# EAGLE design robot_board (EAGLE 6.5.0)
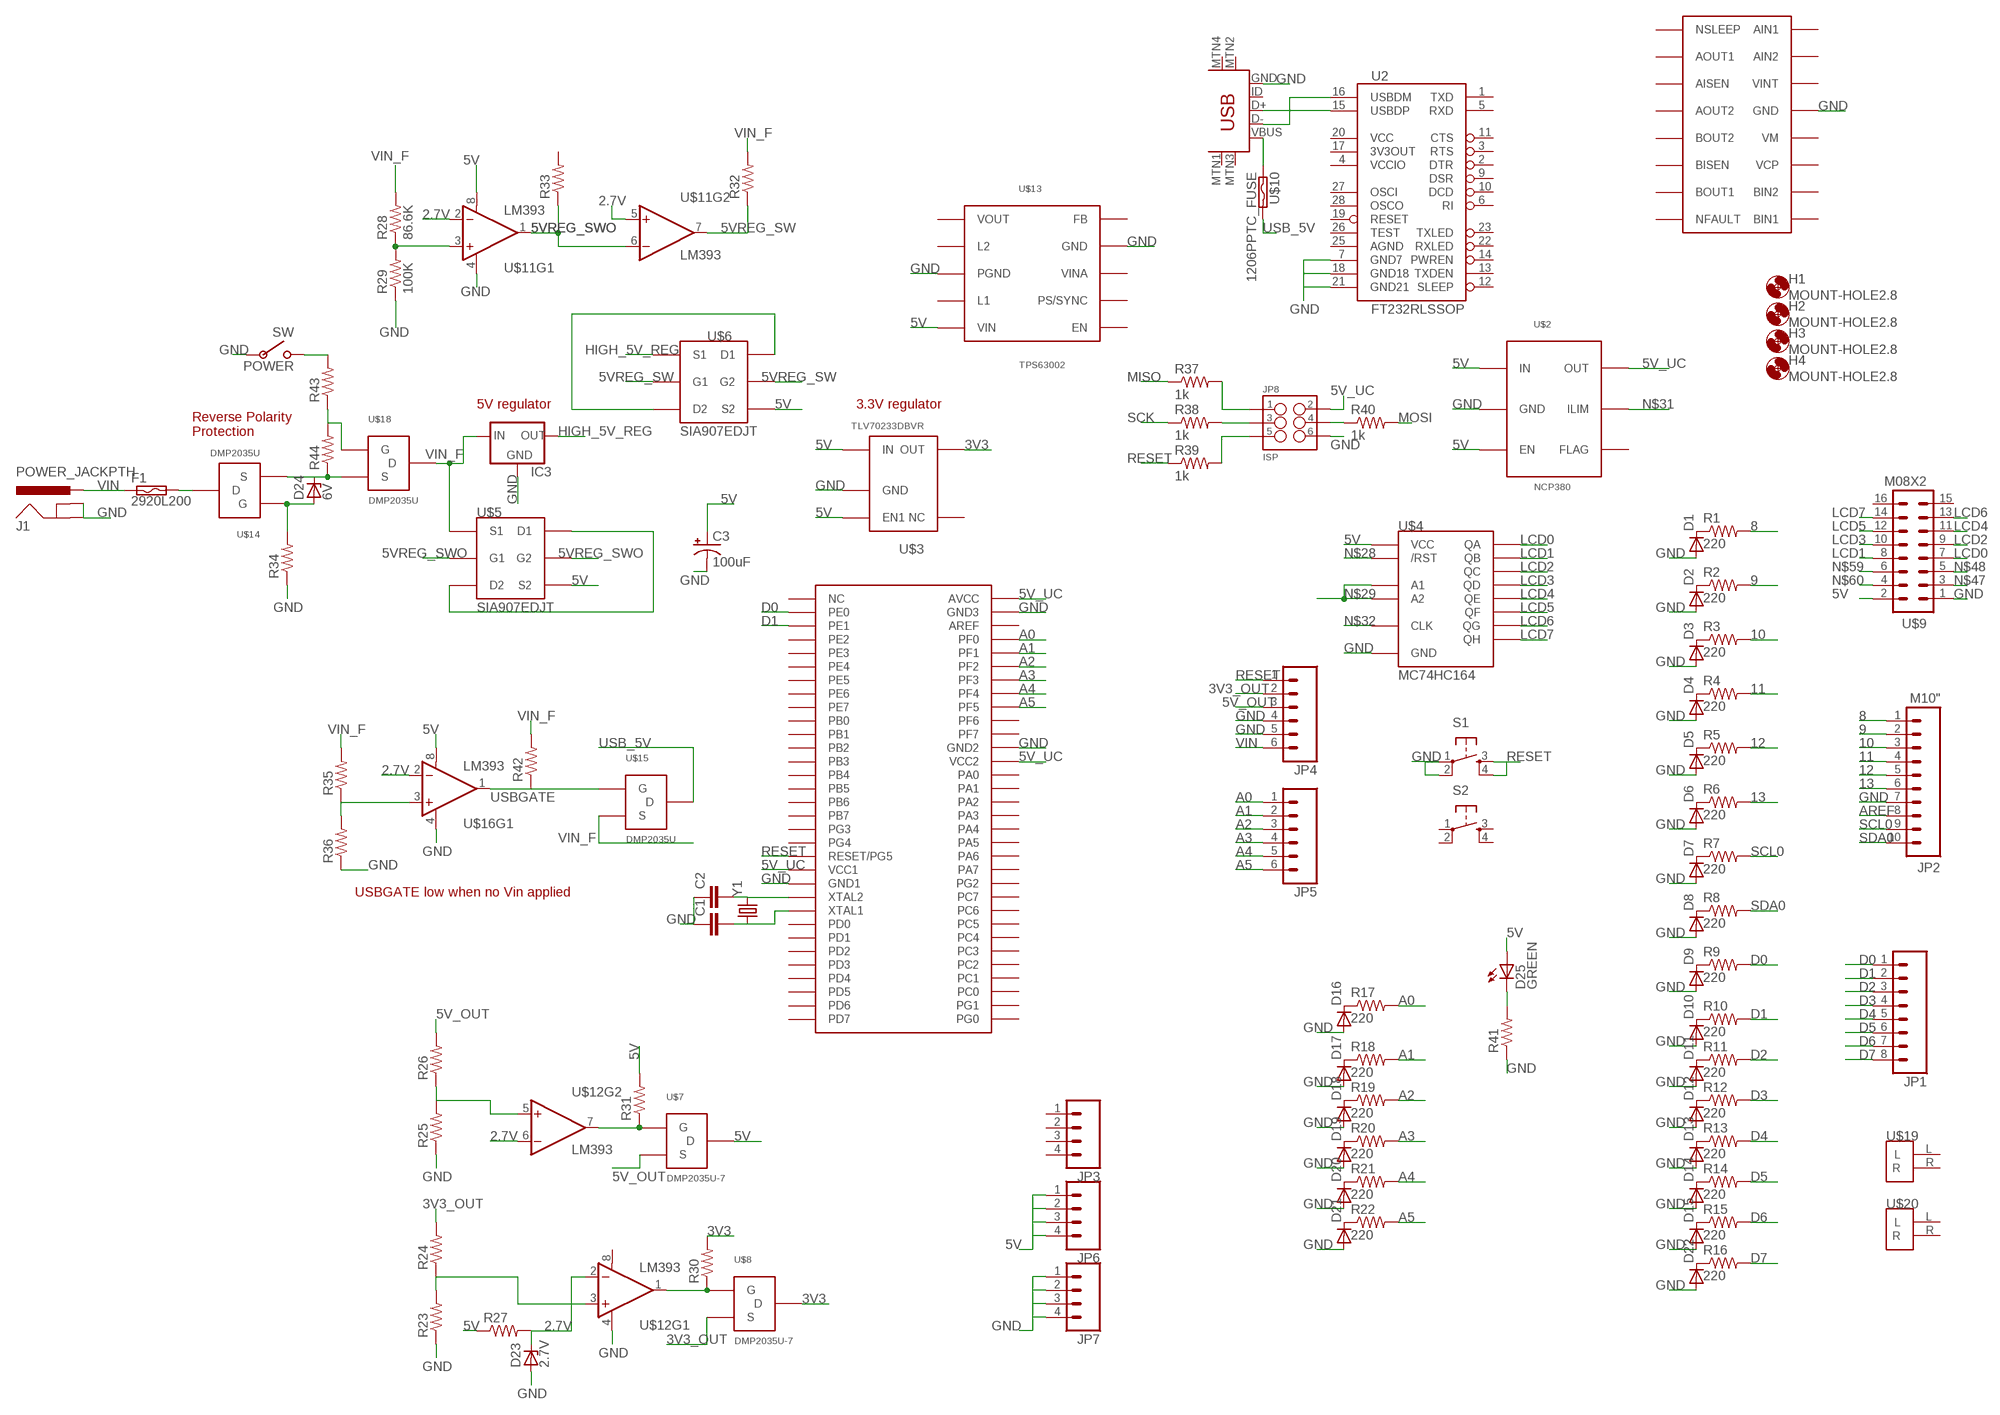
[diagram p0: schematic, sheet 1]

## Parts
C1  CAP0805  [0805]
C2  CAP0805  [0805]
C3  100uF  CAP_POLD  [PANASONIC_D]
D1  DIODESOT23  [SOT23-3]
D2  DIODESOT23  [SOT23-3]
D3  DIODESOT23  [SOT23-3]
D4  DIODESOT23  [SOT23-3]
D5  DIODESOT23  [SOT23-3]
D6  DIODESOT23  [SOT23-3]
D7  DIODESOT23  [SOT23-3]
D8  DIODESOT23  [SOT23-3]
D9  DIODESOT23  [SOT23-3]
D10  DIODESOT23  [SOT23-3]
D11  DIODESOT23  [SOT23-3]
D12  DIODESOT23  [SOT23-3]
D13  DIODESOT23  [SOT23-3]
D14  DIODESOT23  [SOT23-3]
D15  DIODESOT23  [SOT23-3]
D16  DIODESOT23  [SOT23-3]
D17  DIODESOT23  [SOT23-3]
D18  DIODESOT23  [SOT23-3]
D19  DIODESOT23  [SOT23-3]
D20  DIODESOT23  [SOT23-3]
D21  DIODESOT23  [SOT23-3]
D22  DIODESOT23  [SOT23-3]
D23  2.7V  ZENER-DIODESOD80C  [SOD80C]
D24  6V  ZENER-DIODESOD80C  [SOD80C]
D25  GREEN  LED-GREENLILYPAD  [LED-1206]
F1  2920L200  [SMD050F]
H1  MOUNT-HOLE2.8  [2,8]
H2  MOUNT-HOLE2.8  [2,8]
H3  MOUNT-HOLE2.8  [2,8]
H4  MOUNT-HOLE2.8  [2,8]
IC3  78XXS  [78XXS]
J1  POWER_JACKPTH  [POWER_JACK_PTH]
JP1  M081X08  [1X08]
JP2  M10"  [1X10]
JP3  M04PTH  [1X04]
JP4  M06SIP  [1X06]
JP5  M06SIP  [1X06]
JP6  M04PTH  [1X04]
JP7  M04PTH  [1X04]
JP8  ISP  M03X22X3_SILK_SM  [2X3]
POWER  SW  [SW]
R1  220  R-US_R1206  [R1206]
R2  220  R-US_R1206  [R1206]
R3  220  R-US_R1206  [R1206]
R4  220  R-US_R1206  [R1206]
R5  220  R-US_R1206  [R1206]
R6  220  R-US_R1206  [R1206]
R7  220  R-US_R1206  [R1206]
R8  220  R-US_R1206  [R1206]
R9  220  R-US_R1206  [R1206]
R10  220  R-US_R1206  [R1206]
R11  220  R-US_R1206  [R1206]
R12  220  R-US_R1206  [R1206]
R13  220  R-US_R1206  [R1206]
R14  220  R-US_R1206  [R1206]
R15  220  R-US_R1206  [R1206]
R16  220  R-US_R1206  [R1206]
R17  220  R-US_R1206  [R1206]
R18  220  R-US_R1206  [R1206]
R19  220  R-US_R1206  [R1206]
R20  220  R-US_R1206  [R1206]
R21  220  R-US_R1206  [R1206]
R22  220  R-US_R1206  [R1206]
R23  R-US_R0805  [R0805]
R24  R-US_R0805  [R0805]
R25  R-US_R0805  [R0805]
R26  R-US_R0805  [R0805]
R27  R-US_R0805  [R0805]
R28  86.6K  R-US_R0805  [R0805]
R29  100K  R-US_R0805  [R0805]
R30  R-US_R0805  [R0805]
R31  R-US_R0805  [R0805]
R32  R-US_R0805  [R0805]
R33  R-US_R0805  [R0805]
R34  R-US_R1206  [R1206]
R35  R-US_R1206  [R1206]
R36  R-US_R1206  [R1206]
R37  1k  R-US_R1206  [R1206]
R38  1k  R-US_R1206  [R1206]
R39  1k  R-US_R1206  [R1206]
R40  1k  R-US_R1206  [R1206]
R41  R-US_R1206  [R1206]
R42  R-US_R1206  [R1206]
R43  R-US_R1206  [R1206]
R44  R-US_R1206  [R1206]
S1  TAC_SWITCHPTH  [TACTILE-PTH]
S2  TAC_SWITCHPTH  [TACTILE-PTH]
U2  FT232RLSSOP  [SSOP28DB]
U$1  USB-MINIB-5PIN  [USB-MINIB]
U$2  NCP380  [TSOP-5]
U$3  TLV70233DBVR  [SOT-23-5]
U$4  MC74HC164  [TSSOP-14]
U$5  SIA907EDJT  [SC70T]
U$6  SIA907EDJT  [SC70T]
U$7  DMP2035U-7  [SOT23]
U$8  DMP2035U-7  [SOT23]
U$9  M08X2  [2X8]
U$10  1206PPTC_FUSE  [R1206]
U$11  LM393  [SO08]
U$12  LM393  [SO08]
U$13  TPS63002  [10SON]
U$14  DMP2035U  [SOT23]
U$15  DMP2035U  [SOT23]
U$16  LM393  [SO08]
U$17  ATMEGA325PA  [TQFP64]
U$18  DMP2035U  [SOT23]
U$19  2POS_TERMINAL  [2POS_TERMINAL]
U$20  2POS_TERMINAL  [2POS_TERMINAL]
U$21  DRV8833  [TSSOP16]
Y1  CRYSTAL10.5X4.8  [CRYSTAL-SMD-10.5X4.8-2PIN]

## Nets
2.7V: D23.C R27.2 U$11.2(-IN) U$11.5(+IN) U$12.2(-IN) U$12.6(-IN) U$16.2(-IN)
3V3: R30.2 U$3.P$4(OUT) U$8.3(D)
3V3_OUT: JP4.2 R24.2 U$8.2(S)
5V: C3.+ D25.A JP6.1 JP6.2 JP6.3 JP6.4 R27.1 R31.2 U$2.P$4(IN) U$2.P$6(EN) U$3.P$1(IN) U$3.P$3(EN1) U$4.14(VCC) U$5.P$4(S2) U$6.P$4(S2) U$7.3(D) U$9.2 U$11.8(V+) U$13.P$5(VIN) U$16.8(V+)
5V_OUT: JP4.3 R26.2 U$7.2(S)
5V_UC: JP8.2 U$2.P$1(OUT) U$17.21(VCC1) U$17.52(VCC2) U$17.64(AVCC)
5VREG_SW: R32.1 U$6.P$2(G1) U$6.P$5(G2) U$11.7(OUT)
5VREG_SWO: R33.1 U$5.P$2(G1) U$5.P$5(G2) U$11.1(OUT) U$11.6(-IN)
8: JP2.1 R1.2
9: JP2.2 R2.2
10: JP2.3 R3.2
11: JP2.4 R4.2
12: JP2.5 R5.2
13: JP2.6 R6.2
A0: JP5.1 R17.2 U$17.61(PF0)
A1: JP5.2 R18.2 U$17.60(PF1)
A2: JP5.3 R19.2 U$17.59(PF2)
A3: JP5.4 R20.2 U$17.58(PF3)
A4: JP5.5 R21.2 U$17.57(PF4)
A5: JP5.6 R22.2 U$17.56(PF5)
AREF: JP2.8
D0: JP1.1 R9.2 U$17.2(PE0)
D1: JP1.2 R10.2 U$17.3(PE1)
D2: JP1.3 R11.2
D3: JP1.4 R12.2
D4: JP1.5 R13.2
D5: JP1.6 R14.2
D6: JP1.7 R15.2
D7: JP1.8 R16.2
GND: C1.1 C2.1 C3.- D1.1(A) D2.1(A) D3.1(A) D4.1(A) D5.1(A) D6.1(A) D7.1(A) D8.1(A) D9.1(A) D10.1(A) D11.1(A) D12.1(A) D13.1(A) D14.1(A) D15.1(A) D16.1(A) D17.1(A) D18.1(A) D19.1(A) D20.1(A) D21.1(A) D22.1(A) D23.A IC3.GND J1.GND J1.GNDBREAK JP2.7 JP4.4 JP4.5 JP7.1 JP7.2 JP7.3 JP7.4 JP8.6 POWER.P$2 R23.1 R25.1 R29.1 R34.1 R36.1 R41.1 S1.1 S1.2 U2.7(GND7) U2.18(GND18) U2.21(GND21) U$1.GND U$2.P$5(GND) U$3.P$2(GND) U$4.7(GND) U$9.1 U$11.4(V-) U$12.4(V-) U$13.P$3(PGND) U$13.P$9(GND) U$16.4(V-) U$17.22(GND1) U$17.53(GND2) U$17.63(GND3) U$21.13(GND)
HIGH_5V_REG: IC3.OUT U$6.P$1(S1)
LCD0: U$4.3(QA) U$9.7
LCD1: U$4.4(QB) U$9.8
LCD2: U$4.5(QC) U$9.9
LCD3: U$4.6(QD) U$9.10
LCD4: U$4.10(QE) U$9.11
LCD5: U$4.11(QF) U$9.12
LCD6: U$4.12(QG) U$9.13
LCD7: U$4.13(QH) U$9.14
MISO: R37.1
MOSI: R40.2
N$1: U2.16(USBDM) U$1.D-
N$2: U2.15(USBDP) U$1.D+
N$3: C2.2 Y1.P$2
N$4: C1.2 Y1.P$1
N$5: D1.3(C) R1.1
N$6: D2.3(C) R2.1
N$7: D3.3(C) R3.1
N$8: D4.3(C) R4.1
N$9: D5.3(C) R5.1
N$10: D6.3(C) R6.1
N$11: D7.3(C) R7.1
N$12: D8.3(C) R8.1
N$13: D9.3(C) R9.1
N$14: D10.3(C) R10.1
N$15: D11.3(C) R11.1
N$16: D12.3(C) R12.1
N$17: D13.3(C) R13.1
N$18: D14.3(C) R14.1
N$19: D15.3(C) R15.1
N$20: D22.3(C) R16.1
N$21: D16.3(C) R17.1
N$22: D17.3(C) R18.1
N$23: D18.3(C) R19.1
N$24: D19.3(C) R20.1
N$25: D20.3(C) R21.1
N$26: D21.3(C) R22.1
N$27: U$1.VBUS U$10.1
N$28: U$4.9(/RST)
N$29: U$4.1(A1) U$4.2(A2)
N$30: R31.1 U$7.1(G) U$12.7(OUT)
N$31: U$2.P$2(ILIM)
N$32: U$4.8(CLK)
N$33: F1.2 U$14.3(D)
N$34: R25.2 R26.1 U$12.5(+IN)
N$35: R28.1 R29.2 U$11.3(+IN)
N$36: D24.A R34.2 U$14.1(G)
N$37: JP8.4 R40.1
N$38: R23.2 R24.1 U$12.3(+IN)
N$39: R35.1 R36.2 U$16.3(+IN)
N$40: D24.C R44.1 U$14.2(S) U$18.2(S)
N$41: D25.C R41.2
N$42: U$6.P$3(D2) U$6.P$6(D1)
N$43: POWER.P$1 R43.2
N$44: U$5.P$3(D2) U$5.P$6(D1)
N$45: R30.1 U$8.1(G) U$12.1(OUT)
N$46: JP8.5 R39.2
N$47: U$9.3
N$48: U$9.5
N$49: JP8.3 R38.2
N$50: JP8.1 R37.2
N$51: R43.1 R44.2 U$18.1(G)
N$59: U$9.6
N$60: U$9.4
RESET: JP4.1 R39.1 S1.3 S1.4 U$17.20(RESET/PG5)
SCK: R38.1
SCL0: JP2.9 R7.2
SDA0: JP2.10 R8.2
USB_5V: U$10.2 U$15.3(D)
USBGATE: R42.1 U$15.1(G) U$16.1(OUT)
VIN: F1.1 J1.PWR JP4.6
VIN_F: IC3.IN R28.2 R32.2 R35.2 R42.2 U$5.P$1(S1) U$15.2(S) U$18.3(D)
Unconnected: JP3.1 JP3.2 JP3.3 JP3.4 R33.2 S2.1 S2.2 S2.3 S2.4 U2.1(TXD) U2.2(DTR) U2.3(RTS) U2.5(RXD) U2.6(RI) U2.9(DSR) U2.10(DCD) U2.11(CTS) U2.12(SLEEP) U2.13(TXDEN) U2.14(PWREN) U2.17(3V3OUT) U2.19(RESET) U2.22(RXLED) U2.23(TXLED) U2.26(TEST) U2.27(OSCI) U2.28(OSCO) U$1.ID U$1.MTN1(MTN2) U$1.MTN2(MTN3) U$1.MTN3(MTN1) U$1.MTN4 U$2.P$3(FLAG) U$3.P$5(NC) U$9.15 U$9.16 U$13.P$1(VOUT) U$13.P$2(L2) U$13.P$4(L1) U$13.P$6(EN) U$13.P$7(PS/SYNC) U$13.P$8(VINA) U$13.P$10(FB) U$16.5(+IN) U$16.6(-IN) U$16.7(OUT) U$17.1(NC) U$17.4(PE2) U$17.5(PE3) U$17.6(PE4) U$17.7(PE5) U$17.8(PE6) U$17.9(PE7) U$17.10(PB0) U$17.11(PB1) U$17.12(PB2) U$17.13(PB3) U$17.14(PB4) U$17.15(PB5) U$17.16(PB6) U$17.17(PB7) U$17.18(PG3) U$17.19(PG4) U$17.23(XTAL2) U$17.24(XTAL1) U$17.25(PD0) U$17.26(PD1) U$17.27(PD2) U$17.28(PD3) U$17.29(PD4) U$17.30(PD5) U$17.31(PD6) U$17.32(PD7) U$17.33(PG0) U$17.34(PG1) U$17.35(PC0) U$17.36(PC1) U$17.37(PC2) U$17.38(PC3) U$17.39(PC4) U$17.40(PC5) U$17.41(PC6) U$17.42(PC7) U$17.43(PG2) U$17.44(PA7) U$17.45(PA6) U$17.46(PA5) U$17.47(PA4) U$17.48(PA3) U$17.49(PA2) U$17.50(PA1) U$17.51(PA0) U$17.54(PF7) U$17.55(PF6) U$17.62(AREF) U$19.L U$19.R U$20.L U$20.R U$21.1(NSLEEP) U$21.2(AOUT1) U$21.3(AISEN) U$21.4(AOUT2) U$21.5(BOUT2) U$21.6(BISEN) U$21.7(BOUT1) U$21.8(NFAULT) U$21.9(BIN1) U$21.10(BIN2) U$21.11(VCP) U$21.12(VM) U$21.14(VINT) U$21.15(AIN2) U$21.16(AIN1)

## Notes on the sheet
- 5V regulator | 3.3V regulator
- Reverse Polarity
  Protection
- USBGATE low when no Vin applied

## Power pins joined to a net without a drawn wire
AGND: U2.25(AGND)
V+: U$12.8(V+)
VCC: U2.20(VCC)
VCCIO: U2.4(VCCIO)

## Library data of the parts
C1 C2 = SparkFun-Passives:CAP: Capacitor Standard 0603 ceramic capacitor, and 0.1" leaded capacitor.
C3 = SparkFun-Capacitors:CAP_POL: Capacitor Polarized These are standard SMD and PTH capacitors. Normally 10uF, 47uF, and 100uF in electrolytic and tantalum varieties. Always verify the external diameter of the through hole cap, it varies with capacity, voltage, and manufacturer. The EIA devices should be standard.
D1-D22 = SparkFun-DiscreteSemi:DIODE: Diode These are standard reverse protection diodes and small signal diodes. SMA package can handle up to about 1A. SOD-323 can handle about 200mA. What the SOD-323 package when ordering, there are some mfgs out there that are 5-pin packages.
D23 D24 = diode:ZENER-DIODE: Z-Diode
D25 = SparkFun-LED:LED-GREEN: Various green LEDs 0603- DIO-00821 LARGE- DIO-00862 LILYPAD- DIO-09910; PROD_ID: DIO-09910
F1 = jseng:2920L200: PolySwitch (TM) Resettable Device Source: Data sheet <http://www.farnell.com/datasheets/13482.pdf>
H1-H4 = holes:MOUNT-HOLE: MOUNTING HOLE with drill center marker
IC3 = v-reg:78XXS: VOLTAGE REGULATOR
J1 = SparkFun-Connectors:POWER_JACK: Power Jack This is the standard 5.5mm barrel jack for power. The PTH is the most common, proven, reliable, footprint. The Slot footprint only works if the mill layer is transmitted to the PCB fab house so be warned. Mating wall wart : TOL-00298 (and others); PROD_ID: PRT-00119
JP1 = SparkFun-Connectors:M08: Header 8 Standard 8-pin 0.1" header. Use with straight break away headers (SKU : PRT-00116), right angle break away headers (PRT-00553), swiss pins (PRT-00743), machine pins (PRT-00117), and female headers (PRT-00115).
JP2 = SparkFun-Connectors:M10: Header 10 Standard 10-pin 0.1" header. Use with straight break away headers (SKU : PRT-00116), right angle break away headers (PRT-00553), swiss pins (PRT-00743), machine pins (PRT-00117), and female headers (PRT-00115).
JP3 JP6 JP7 = SparkFun-Connectors:M04: Header 4 Standard 4-pin 0.1" header. Use with straight break away headers (SKU : PRT-00116), right angle break away headers (PRT-00553), swiss pins (PRT-00743), machine pins (PRT-00117), and female headers (PRT-00115). Molex polarized connector foot print use with SKU : PRT-08231 with associated crimp pins and housings. 1MM SMD Version SKU: PRT-10208
JP4 JP5 = SparkFun-Connectors:M06: Header 6 Standard 6-pin 0.1" header. Use with straight break away headers (SKU : PRT-00116), right angle break away headers (PRT-00553), swiss pins (PRT-00743), machine pins (PRT-00117), and female headers (PRT-00115). Molex polarized connector foot print use with SKU : PRT-08094 with associated crimp pins and housings. NOTES ON THE VARIANTS LOCK and LOCK_LONGPADS... This footprint was designed to help hold the alignment of a through-hole component (i.e. 6-pin header) while soldering it into place. You may notice that each hole has been shifted either up or down by 0.005 of an inch from it's more standard position (which is a perfectly straight line). This slight alteration caused the pins (the squares in the middle) to touch the edges of the holes. Because they are alternating, it causes a "brace" to hold the component in place. 0.005 has proven to be the perfect amount of "off-center" position when using our standard breakaway headers. Although looks a little odd when you look at the bare footprint, once you have a header in there, the alteration is very hard to notice. Also,if you push a header all the way into place, it is covered up entirely on the bottom side. This idea of altering the position of holes to aid alignment will be further integrated into the Sparkfun Library for other footprints. It can help hold any component with 3 or more connection pins.
JP8 = SparkFun-Connectors:M03X2: 2x3 .1" header. Shrouded, with keying- CONN-10681 SMT- CONN-11415 Pogo pins- HW-11044
POWER = r_cubed:SW
R1-R44 = resistor:R-US_: RESISTOR, American symbol
S1 S2 = SparkFun-Electromechanical:TAC_SWITCH: Momentary Switch Button commonly used for reset or general input. Spark Fun Electronics SKU : COM-00097 SMT- SWCH-08247
U2 = SparkFun-DigitalIC:FT232RL: USB UART FT232RL 4th Generation USB UART (USB <-> Serial) Controller. Spark Fun Electronics SKU : COM-00650 Production SKU IC-00870; PROD_ID: IC-00870
U$1 = SparkFun-Connectors:USB-MINIB: Mini-USB "B" connector with 5th pin broken out. Created new symbol breaking out 5th "ID" pin in mini/micro USB connector spec. See: http://en.wikipedia.org/wiki/Mini_usb#Cables. Uses same footprint as 4-pin symbol. Also added pins to connect to mounting / shield pads if required (probably not generally needed as signals aren't shielded once they leave the connector).
U$2 = jseng:NCP380: ON-Semiconductor NCP380 Power distribution switch
U$3 = jseng:TLV70233DBVR: TLV70233 - 3.3V 350mA regulator
U$4 = r_cubed:MC74HC164
U$5 U$6 = jseng:SIA907EDJT
U$7 U$8 = jseng:DMP2035U-7: Diodes Inc. DMP2035U-7 P-channel logic level mosfet
U$9 = SparkFun-Connectors:M08X2: .1" headers, two rows of 8 each
U$10 = jseng:1206PPTC_FUSE
U$11 U$12 U$16 = SparkFun-AnalogIC:LM393: Low-voltage comparator
U$13 = jseng:TPS63002: TPS63002 - 5V buck-boost switching regulator
U$14 U$15 U$18 = jseng:DMP2035U: Diodes Inc. DMP2035U-7 P-channel logic level mosfet
U$17 = jseng:ATMEGA325PA
U$19 U$20 = r_cubed:2POS_TERMINAL
U$21 = jseng:DRV8833
Y1 = SparkFun-FreqCtrl:CRYSTAL: Various standard crystals. Proven footprints. Spark Fun Electronics SKU : COM-00534

## Board
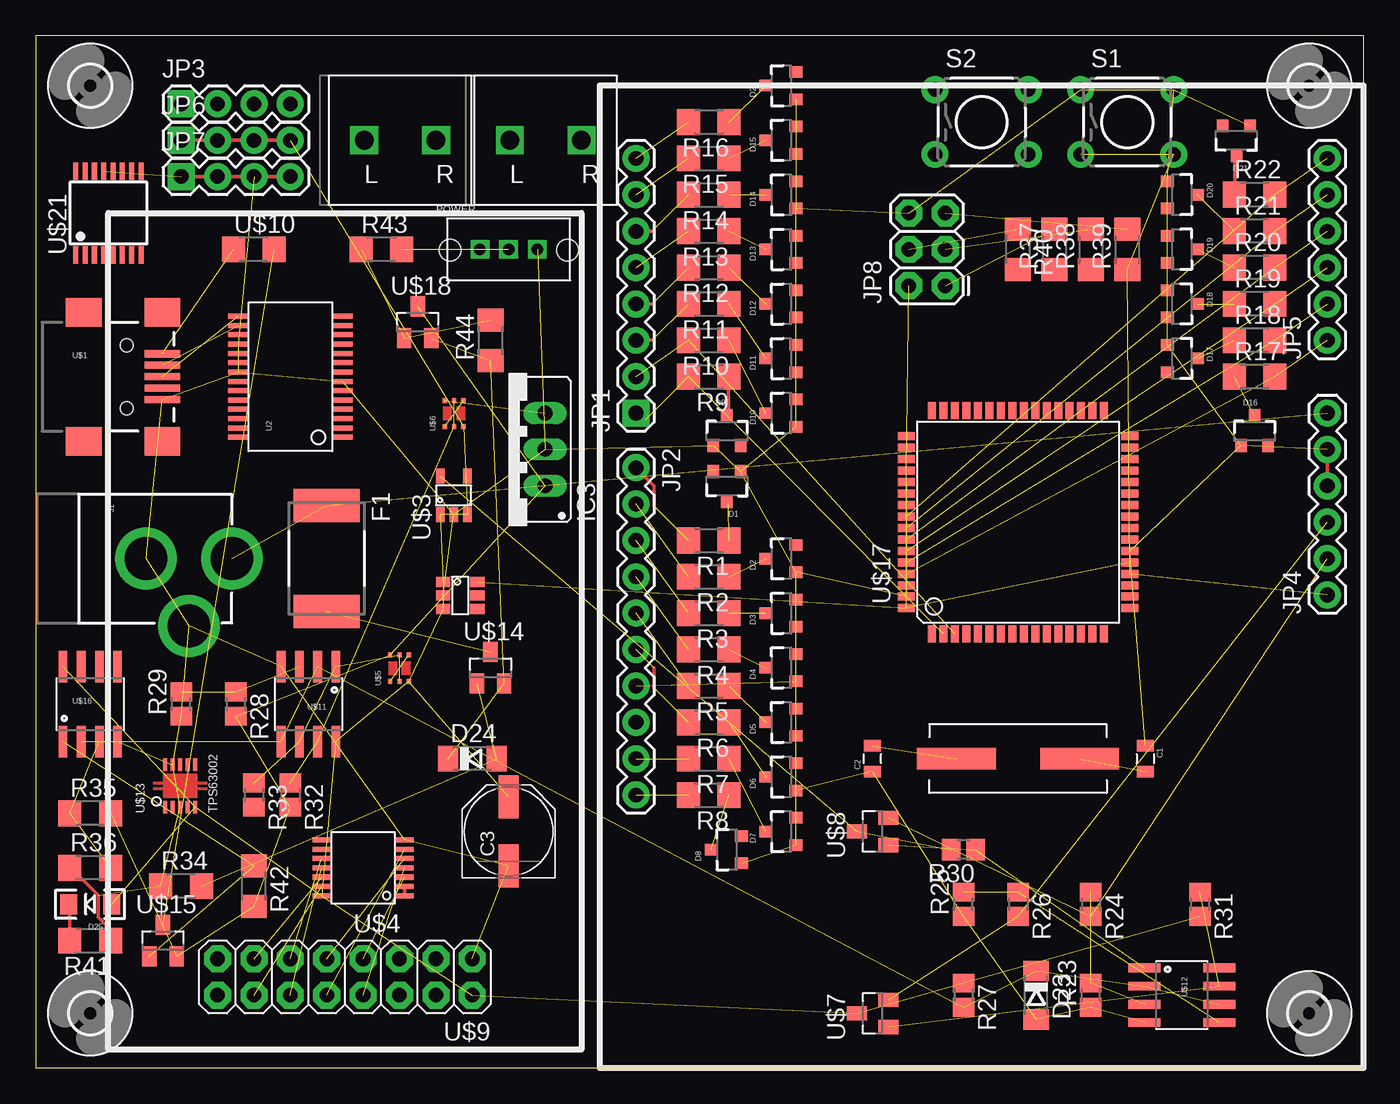
[diagram p1: board, top side]

Size 92.7 x 72.06 mm. Coordinates in mm from the lower left corner, seen from the top.
Outline: 92.7,0 92.7,72.06 0,72.06 0,0 92.7,0
Copper layers (1*16): Top 0.035mm / dielectric 1.5mm / Bottom 0.035mm
Design rules "default": minimum track width 10mil, minimum drill 24mil, track to track 8mil, track to pad 8mil, pad to pad 8mil, via to via 8mil, smd to smd 8mil, copper to edge 40mil, drill to drill 8mil, minimum pad ring 10mil, minimum via ring 8mil, stop-mask expansion 4mil, vias tented up to drill 0mil, thermal gap 10mil

### Footprints (pad centres in the part's own frame; a part is rotated, then mirrored left to right if it is on the bottom)
0805 = smd 0.8 x 1.2: 1 -0.9,0; 2 0.9,0
PANASONIC_D = smd 3 x 1.4: + 2.4,0; - -2.4,0
SOT23-3 = smd 0.8 x 0.9: 1 -0.95,-1; 2 0.95,-1; 3 0,1.1
SOD80C = smd 1.4 x 1.8: A 1.7,0; C -1.7,0
LED-1206 = smd 1.2 x 1.4: A -1.5,0; C 1.5,0
SMD050F = smd 2.3 x 4.6: 1 -3.7,0; 2 3.7,0
2,8 = hole 2.8: 0,0
78XXS = drill 1.016 long: GND 0,-2.54; IN -2.54,-2.54; OUT 2.54,-2.54
POWER_JACK_PTH = drill 2.997 pad 4.318: GND 0,7.7; GNDBREAK 4.7,10.7; PWR 0,13.7
1X08 = drill 1.016 pad 1.88 square: 1 0,0 | drill 1.016 pad 1.88: 2 2.54,0; 3 5.08,0; 4 7.62,0; 5 10.16,0; 6 12.7,0; 7 15.24,0; 8 17.78,0
1X10 = drill 1.016 pad 1.88: 1 0,0; 2 2.54,0; 3 5.08,0; 4 7.62,0; 5 10.16,0; 6 12.7,0; 7 15.24,0; 8 17.78,0; 9 20.32,0; 10 22.86,0
1X04 = drill 1.016 pad 1.88 square: 1 0,0 | drill 1.016 pad 1.88: 2 2.54,0; 3 5.08,0; 4 7.62,0
1X06 = drill 1.016 pad 1.88: 1 0,0; 2 2.54,0; 3 5.08,0; 4 7.62,0; 5 10.16,0; 6 12.7,0
2X3 = drill 1.016 pad 1.88 octagon: 1 0,0; 2 0,2.54; 3 2.54,0; 4 2.54,2.54; 5 5.08,0; 6 5.08,2.54
SW = drill 0.8 square: P$1 0,0; P$2 2,0; P$3 -2,0 | hole 1.5: -4.1,-0.04; 4.1,-0.04
R1206 = smd 1.6 x 1.803: 1 -1.422,0; 2 1.422,0
R0805 = smd 1.3 x 1.5: 1 -0.85,0; 2 0.85,0
TACTILE-PTH = drill 1.016 pad 1.88: 1 -3.251,2.261; 2 3.251,2.261; 3 -3.251,-2.261; 4 3.251,-2.261
SSOP28DB = smd 0.348 x 1.397: 1 -4.225,-3.656; 2 -3.575,-3.656; 3 -2.925,-3.656; 4 -2.275,-3.656; 5 -1.625,-3.656; 6 -0.975,-3.656; 7 -0.325,-3.656; 8 0.325,-3.656; 9 0.975,-3.656; 10 1.625,-3.656; 11 2.275,-3.656; 12 2.925,-3.656; 13 3.575,-3.656; 14 4.225,-3.656; 15 4.225,3.656; 16 3.575,3.656; 17 2.925,3.656; 18 2.275,3.656; 19 1.625,3.656; 20 0.975,3.656; 21 0.325,3.656; 22 -0.325,3.656; 23 -0.975,3.656; 24 -1.625,3.656; 25 -2.275,3.656; 26 -2.925,3.656; 27 -3.575,3.656; 28 -4.225,3.656
USB-MINIB = smd 2.5 x 0.5: D+ 2.5,0; D- 2.5,0.8; GND 2.5,-1.6; ID 2.5,-0.8; VBUS 2.5,1.6 | smd 2.5 x 2: MTN1 -3,4.5; MTN2 2.5,4.5; MTN3 -3,-4.5; MTN4 2.5,-4.5 | hole 0.9: 0,2.2; 0,-2.2
TSOP-5 = smd 0.7 x 1: P$1 0.35,2.9; P$2 1.3,2.9; P$3 2.25,2.9; P$4 0.35,0.5; P$5 1.3,0.5; P$6 2.25,0.5
SOT-23-5 = smd 1.05 x 0.6: P$1 0.53,2.24; P$2 0.53,1.29; P$3 0.53,0.34; P$4 3.23,2.24; P$5 3.23,0.35
TSSOP-14 = smd 1.26 x 0.36: 1 -2.9,1.95; 2 -2.9,1.3; 3 -2.9,0.65; 4 -2.9,0; 5 -2.9,-0.65; 6 -2.9,-1.3; 7 -2.9,-1.95; 8 2.9,-1.95; 9 2.9,-1.3; 10 2.9,-0.65; 11 2.9,0; 12 2.9,0.65; 13 2.9,1.3; 14 2.9,1.95
SC70T = smd 0.3 x 0.35: P$1 -0.65,0.89; P$2 0,0.89; P$3 0.65,0.89; P$4 0.65,-0.94; P$5 0,-0.94; P$6 -0.65,-0.94
SOT23 = smd 1 x 1.4: 1 -0.95,-1.1; 2 0.95,-1.1; 3 0,1.1
2X8 = drill 1.016 pad 1.88 octagon: 1 0,0; 2 0,2.54; 3 2.54,0; 4 2.54,2.54; 5 5.08,0; 6 5.08,2.54; 7 7.62,0; 8 7.62,2.54; 9 10.16,0; 10 10.16,2.54; 11 12.7,0; 12 12.7,2.54; 13 15.24,0; 14 15.24,2.54; 15 17.78,0; 16 17.78,2.54
SO08 = smd 0.61 x 2.21: 1 -1.905,-2.616; 2 -0.635,-2.616; 3 0.635,-2.616; 4 1.905,-2.616; 5 1.905,2.616; 6 0.635,2.616; 7 -0.635,2.616; 8 -1.905,2.616
10SON = smd 0.28 x 0.85: P$1 0.14,0.43; P$2 0.67,0.43; P$3 1.2,0.43; P$4 1.73,0.43; P$5 2.25,0.43; P$6 2.25,3.39; P$7 1.73,3.39; P$8 1.2,3.39; P$9 0.67,3.39; P$10 0.14,3.39
TQFP64 = smd 1.194 x 0.559: 1 -7.8,6; 2 -7.8,5.2; 3 -7.8,4.4; 4 -7.8,3.6; 5 -7.8,2.8; 6 -7.8,2; 7 -7.8,1.2; 8 -7.8,0.4; 9 -7.8,-0.4; 10 -7.8,-1.2; 11 -7.8,-2; 12 -7.8,-2.8; 13 -7.8,-3.6; 14 -7.8,-4.4; 15 -7.8,-5.2; 16 -7.8,-6; 33 7.8,-6; 34 7.8,-5.2; 35 7.8,-4.4; 36 7.8,-3.6; 37 7.8,-2.8; 38 7.8,-2; 39 7.8,-1.2; 40 7.8,-0.4; 41 7.8,0.4; 42 7.8,1.2; 43 7.8,2; 44 7.8,2.8; 45 7.8,3.6; 46 7.8,4.4; 47 7.8,5.2; 48 7.8,6 | smd 0.559 x 1.194: 17 -6,-7.8; 18 -5.2,-7.8; 19 -4.4,-7.8; 20 -3.6,-7.8; 21 -2.8,-7.8; 22 -2,-7.8; 23 -1.2,-7.8; 24 -0.4,-7.8; 25 0.4,-7.8; 26 1.2,-7.8; 27 2,-7.8; 28 2.8,-7.8; 29 3.6,-7.8; 30 4.4,-7.8; 31 5.2,-7.8; 32 6,-7.8; 49 6,7.8; 50 5.2,7.8; 51 4.4,7.8; 52 3.6,7.8; 53 2.8,7.8; 54 2,7.8; 55 1.2,7.8; 56 0.4,7.8; 57 -0.4,7.8; 58 -1.2,7.8; 59 -2,7.8; 60 -2.8,7.8; 61 -3.6,7.8; 62 -4.4,7.8; 63 -5.2,7.8; 64 -6,7.8
2POS_TERMINAL = drill 1.3 square: L -5,0; R 0,0
TSSOP16 = smd 0.35 x 1.2: 1 -2.275,-2.925; 2 -1.625,-2.925; 3 -0.975,-2.925; 4 -0.325,-2.925; 5 0.325,-2.925; 6 0.975,-2.925; 7 1.625,-2.925; 8 2.275,-2.925; 9 2.275,2.925; 10 1.625,2.925; 11 0.975,2.925; 12 0.325,2.925; 13 -0.325,2.925; 14 -0.975,2.925; 15 -1.625,2.925; 16 -2.275,2.925
CRYSTAL-SMD-10.5X4.8-2PIN = smd 5.5 x 1.5: P$1 -4.3,0; P$2 4.3,0

### Placement (x,y rotation side)
C1  77.46,21.59 270 top
C2  58.41,21.59 90 top
C3  33.01,16.51 90 top
D1  48.25,40.64 180 top
D2  52.06,35.56 90 top
D3  52.06,31.75 90 top
D4  52.06,27.94 90 top
D5  52.06,24.13 90 top
D6  52.06,20.32 90 top
D7  52.06,16.51 90 top
D8  48.25,15.24 90 top
D9  48.25,44.45 0 top
D10  52.06,45.72 90 top
D11  52.06,49.53 90 top
D12  52.06,53.34 90 top
D13  52.06,57.15 90 top
D14  52.06,60.96 90 top
D15  52.06,64.77 90 top
D16  85.08,44.45 0 top
D17  80,49.53 270 top
D18  80,53.34 270 top
D19  80,57.15 270 top
D20  80,60.96 270 top
D21  83.81,64.77 180 top
D22  52.06,68.58 90 top
D23  69.84,5.08 270 top
D24  30.47,21.59 0 top
D25  3.8,11.43 180 top
F1  20.31,35.56 270 top
H1  3.8,3.81 90 top
H2  3.8,68.58 90 top
H3  88.89,3.81 90 top
H4  88.89,68.58 90 top
IC3  33.01,43.18 90 top
J1  -0.01,35.56 270 top
JP1  41.9,45.72 90 top
JP2  41.9,41.91 270 top
JP3  10.15,67.31 0 top
JP4  90.16,33.02 90 top
JP5  90.16,50.8 90 top
JP6  10.15,64.77 0 top
JP7  10.15,62.23 0 top
JP8  63.49,54.61 90 top
POWER  33.01,57.15 0 top
R1  46.98,36.83 180 top
R2  46.98,34.29 180 top
R3  46.98,31.75 180 top
R4  46.98,29.21 180 top
R5  46.98,26.67 180 top
R6  46.98,24.13 180 top
R7  46.98,21.59 180 top
R8  46.98,19.05 180 top
R9  46.98,48.26 180 top
R10  46.98,50.8 180 top
R11  46.98,53.34 180 top
R12  46.98,55.88 180 top
R13  46.98,58.42 180 top
R14  46.98,60.96 180 top
R15  46.98,63.5 180 top
R16  46.98,66.04 180 top
R17  85.08,48.26 0 top
R18  85.08,50.8 0 top
R19  85.08,53.34 0 top
R20  85.08,55.88 0 top
R21  85.08,58.42 0 top
R22  85.08,60.96 0 top
R23  73.65,5.08 90 top
R24  73.65,11.43 270 top
R25  64.76,11.43 90 top
R26  68.57,11.43 270 top
R27  64.76,5.08 270 top
R28  13.96,25.4 270 top
R29  10.15,25.4 90 top
R30  64.76,15.24 180 top
R31  81.27,11.43 270 top
R32  17.77,19.05 270 top
R33  15.23,19.05 270 top
R34  10.15,12.7 0 top
R35  3.8,17.78 0 top
R36  3.8,13.97 0 top
R37  71.11,57.15 90 top
R38  73.65,57.15 90 top
R39  76.19,57.15 90 top
R40  68.57,57.15 270 top
R41  3.8,8.89 180 top
R42  15.23,12.7 270 top
R43  24.12,57.15 0 top
R44  31.74,50.8 90 top
S1  76.19,66.04 0 top
S2  66.03,66.04 0 top
U2  17.77,48.26 90 top
U$1  6.34,48.26 0 top
U$2  27.93,34.29 270 top
U$3  30.47,38.1 90 top
U$4  22.85,13.97 180 top
U$5  25.39,27.94 0 top
U$6  29.2,45.72 0 top
U$7  58.41,3.81 90 top
U$8  58.41,16.51 90 top
U$9  30.47,7.62 180 top
U$10  15.23,57.15 0 top
U$11  19.04,25.4 180 top
U$12  80,5.08 270 top
U$13  8.88,17.78 0 top
U$14  31.74,27.94 0 top
U$15  8.88,8.89 0 top
U$16  3.8,25.4 0 top
U$17  68.57,38.1 90 top
U$18  26.66,52.07 0 top
U$19  38.09,64.77 0 top
U$20  27.93,64.77 0 top
U$21  5.07,59.69 0 top
Y1  68.57,21.59 180 top

### Tracks (layer width: path | path; a pad name or v marks a point on that pad's centre or on a via)
2.7V  (6 unrouted)
3V3  (2 unrouted)
3V3_OUT  (2 unrouted)
5V  (16 unrouted)
  Top 0.254: JP6.1 JP6.2 JP6.3 JP6.4
5V_OUT  (2 unrouted)
5V_UC  (4 unrouted)
5VREG_SW  (3 unrouted)
5VREG_SWO  (4 unrouted)
8  (1 unrouted)
  Top 0.254: 43.17,39.22 43.17,40.64 JP2.1 | R1.2
9  (1 unrouted)
10  (1 unrouted)
11  (1 unrouted)
12  (1 unrouted)
13  (2 unrouted)
  Top 0.254: 43.17,27.94 43.17,26.52 | R6.2
A0  (2 unrouted)
A1  (2 unrouted)
A2  (2 unrouted)
A3  (2 unrouted)
A4  (2 unrouted)
A5  (2 unrouted)
D0  (2 unrouted)
  Top 0.254: 42.56,45.26 42.56,45.21 JP1.1 | R9.2
D1  (2 unrouted)
D2  (1 unrouted)
  Top 0.254: JP1.3 43.02,50.8 | R11.2
D3  (1 unrouted)
  Top 0.254: JP1.4 43.02,53.34 | R12.2
D4  (1 unrouted)
D5  (1 unrouted)
  Top 0.254: JP1.6 43.02,58.42 | R14.2
D6  (1 unrouted)
D7  (1 unrouted)
GND  (57 unrouted)
  Top 0.254: R36.1 2.43,13.97 4.36,12.04 4.36,10.52 5.53,9.35 R41.1 | JP7.1 JP7.2 JP7.3 JP7.4 | JP4.4 JP4.5
HIGH_5V_REG  (1 unrouted)
LCD0  (1 unrouted)
LCD1  (1 unrouted)
LCD2  (1 unrouted)
LCD3  (1 unrouted)
LCD4  (1 unrouted)
LCD5  (1 unrouted)
LCD6  (1 unrouted)
LCD7  (1 unrouted)
N$1  (1 unrouted)
N$2  (1 unrouted)
N$3  (1 unrouted)
N$4  (1 unrouted)
N$5  (1 unrouted)
  Top 0.254: 48.35,39.42 48.25,39.52 D1.3 | 48.35,36.83 R1.1
N$6  (1 unrouted)
N$7  (1 unrouted)
N$8  (1 unrouted)
N$9  (1 unrouted)
N$10  (1 unrouted)
N$11  (1 unrouted)
N$12  (1 unrouted)
N$13
  Top 0.254: D9.3 48.25,45.57 48.35,45.67 48.35,48.26 R9.1
N$14  (1 unrouted)
N$15  (1 unrouted)
N$16  (1 unrouted)
N$17  (1 unrouted)
N$18  (1 unrouted)
N$19  (1 unrouted)
N$20  (1 unrouted)
N$21  (1 unrouted)
N$22  (1 unrouted)
N$23  (1 unrouted)
N$24  (1 unrouted)
N$25  (1 unrouted)
  Top 0.254: 81.12,60.96 D20.3 | R21.1
N$26
  Top 0.254: D21.3 83.81,63.65 83.71,63.55 83.71,60.96 R22.1
N$27  (1 unrouted)
N$29  (1 unrouted)
  Top 0.254: 25.75,12.04 25.75,12.65 U$4.2
N$30  (2 unrouted)
N$33  (1 unrouted)
N$34  (2 unrouted)
N$35  (2 unrouted)
N$36  (2 unrouted)
N$37  (1 unrouted)
N$38  (2 unrouted)
N$39  (2 unrouted)
N$40  (3 unrouted)
N$41
  Top 0.254: R41.2 2.38,11.38 2.33,11.43 D25.C | R41.2
N$42  (1 unrouted)
N$43  (1 unrouted)
N$44  (1 unrouted)
N$45  (2 unrouted)
N$46  (1 unrouted)
N$49  (1 unrouted)
N$50  (1 unrouted)
N$51  (2 unrouted)
RESET  (4 unrouted)
SCL0  (1 unrouted)
SDA0  (1 unrouted)
USB_5V  (1 unrouted)
USBGATE  (2 unrouted)
VIN  (2 unrouted)
VIN_F  (7 unrouted)